# EAGLE design Rauchmelder 2.2C (EAGLE 7.2.0)
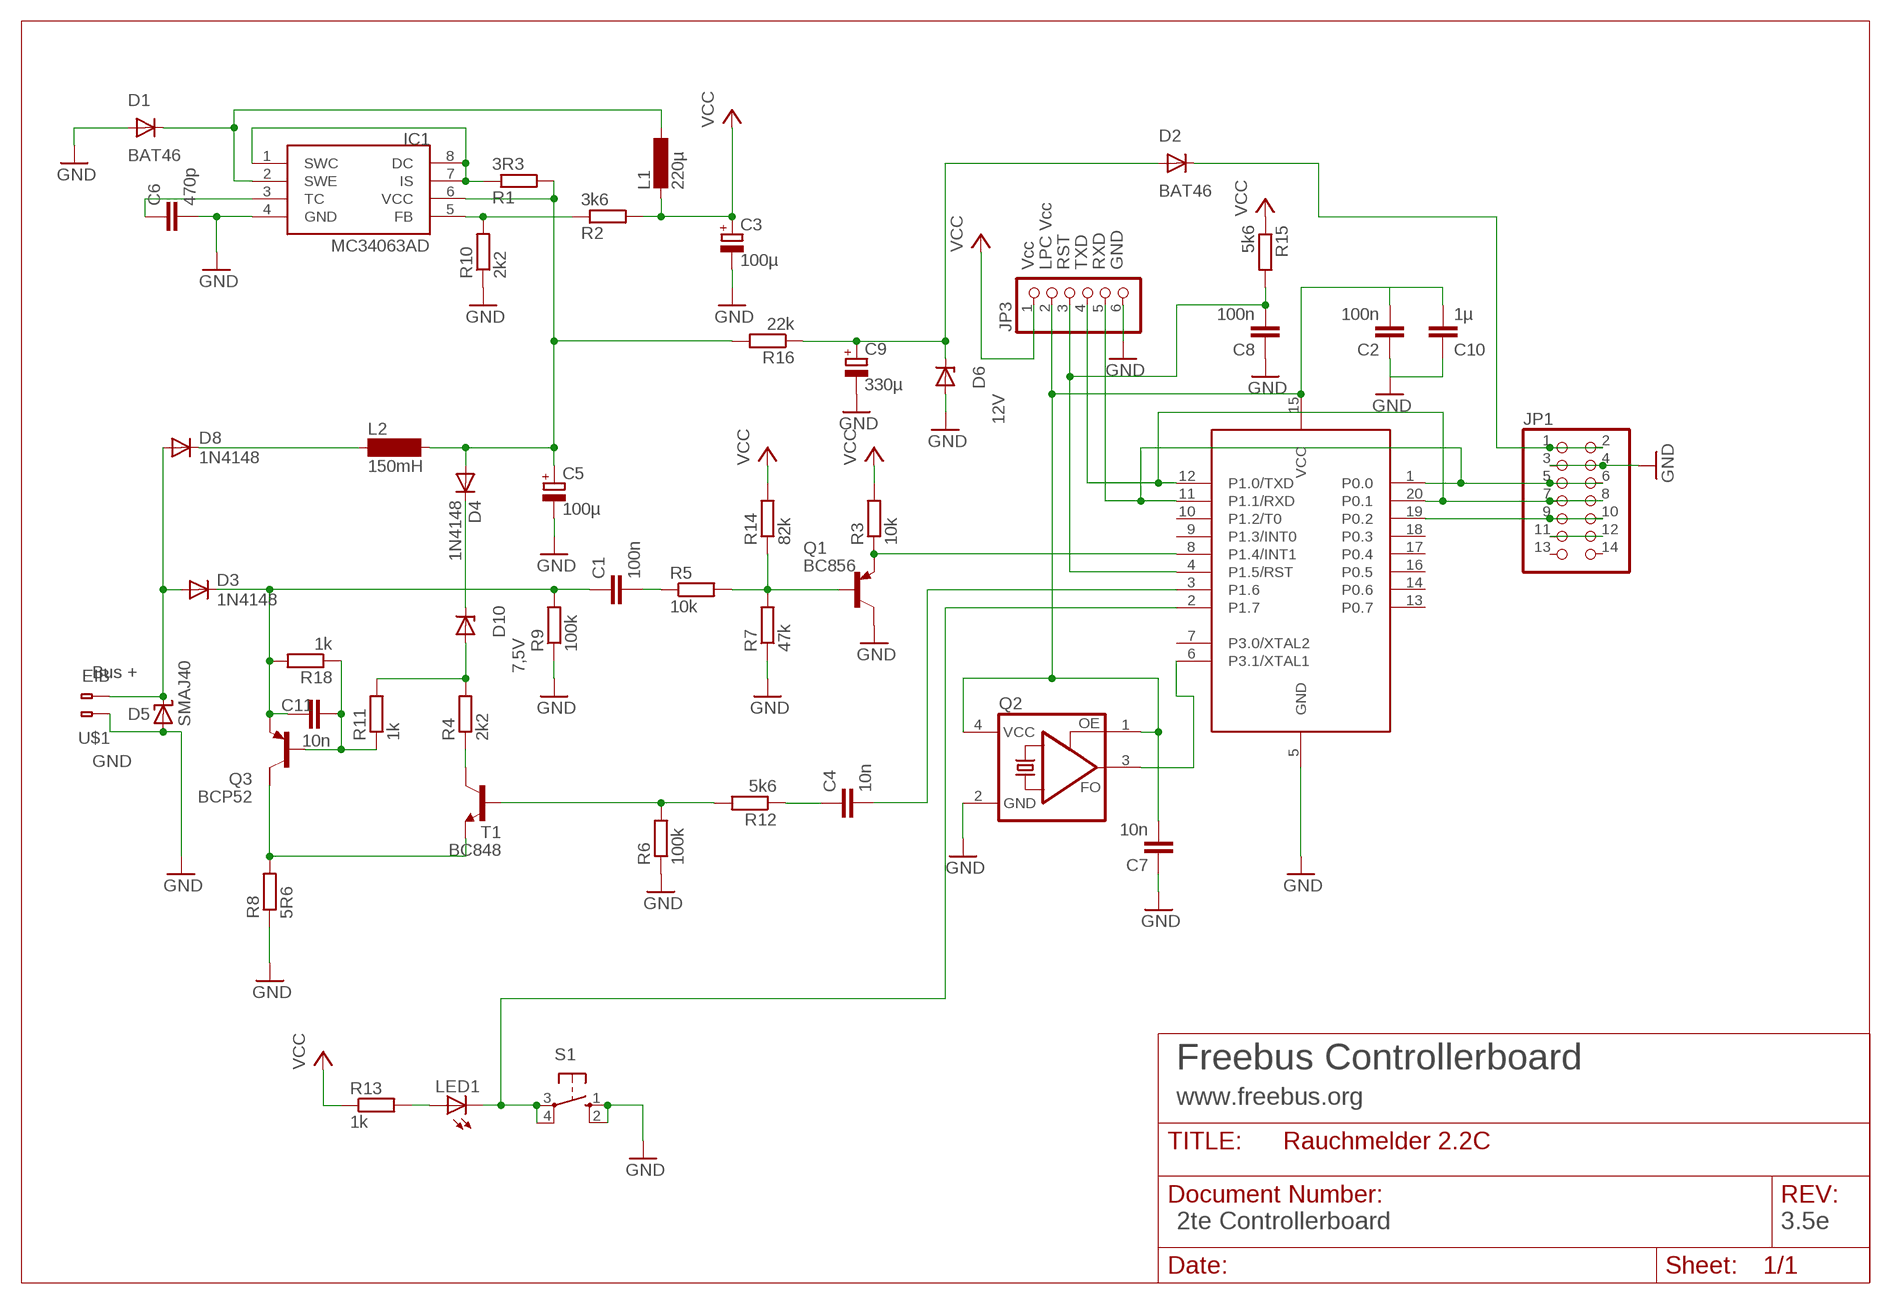
[diagram p0: schematic, sheet 1]

## Parts
C1  100n  C-EUC1206  [C1206]
C2  100n  C-EUC1206  [C1206]
C3  100µ  CPOL-EUSANYO_SMD_B6  [SANYO-OSCON_SMD_B6]
C4  10n  C-EUC1206  [C1206]
C5  100µ  CPOL-EUSANYO_SMD_C6  [SANYO-OSCON_SMD_C6]
C6  470p  C-EUC1206  [C1206]
C7  10n  C-EUC1206  [C1206]
C8  100n  C-EUC1206  [C1206]
C9  330µ  CPOL-EUE3.5-8  [E3,5-8]
C10  1µ  C-EUC1206  [C1206]
C11  10n  C-EUC1206  [C1206]
D1  BAT46  DIODE-MINIMELF  [MINIMELF]
D2  BAT46  DIODE-MINIMELF  [MINIMELF]
D3  1N4148  DIODE-MINIMELF  [MINIMELF]
D4  1N4148  DIODE-MINIMELF  [MINIMELF]
D5  SMAJ40  SUPPRESSOR-SMBJ  [SMBJ]
D6  12V  ZPD  [MINIMELF]
D8  1N4148  DIODE-MINIMELF  [MINIMELF]
D10  7,5V  ZPD  [MINIMELF]
IC1  MC34063AD  [SOIC8]
IC3  LPC922FDH  [TSSOP20]
JP1  PINHD-2X7  [2X07]
JP3  PINHD-1X6  [1X06]
L1  220µ  L-EU0207/10  [0207/10]
L2  150mH  BS11  [BS11]
LED1  LED3MM  [LED3MM]
Q1  BC856  BC856ALT1SMD  [SOT23-BEC]
Q2  ASFL  [ASF]
Q3  BCP52  FZT753SMD  [SOT223]
R1  3R3  R-EU_R1206  [R1206]
R2  3k6  R-EU_R1206  [R1206]
R3  10k  R-EU_R1206  [R1206]
R4  2k2  R-EU_R1206  [R1206]
R5  10k  R-EU_R1206  [R1206]
R6  100k  R-EU_R1206  [R1206]
R7  47k  R-EU_R1206  [R1206]
R8  5R6  R-EU_R1206  [R1206]
R9  100k  R-EU_R1206  [R1206]
R10  2k2  R-EU_R1206  [R1206]
R11  1k  R-EU_R1206  [R1206]
R12  5k6  R-EU_R1206  [R1206]
R13  1k  R-EU_R1206  [R1206]
R14  82k  R-EU_R1206  [R1206]
R15  5k6  R-EU_R1206  [R1206]
R16  22k  R-EU_R1206  [R1206]
R18  1k  R-EU_R1206  [R1206]
S1  10-XX  [B3F-10XX]
T1  BC848  [SOT23]
U$1  EIB  [BUSKLEMME243-724]

## Nets
EIB+: D3.A D5.C D8.A U$1.2(B-2)
GND: C2.1 C3.- C5.- C6.2 C7.1 C8.1 C9.- C10.1 D1.A D5.A D6.A IC1.4(GND) IC3.5(GND) JP1.3 JP1.4 JP3.6 Q1.C Q2.2(GND) R6.1 R7.1 R8.1 R9.1 R10.1 S1.1(S) S1.2(S1) U$1.1(B-1)
N$1: IC3.8(P1.4/INT1) Q1.E R3.1
N$2: Q1.B R5.2 R7.2 R14.1
N$3: IC3.6(P3.1/XTAL1) Q2.3(FO)
N$4: C11.2 Q3.1(B) R11.1 R18.1
N$5: C4.2 IC3.3(P1.6)
N$6: C2.2 C7.2 C10.2 IC3.15(VCC) JP3.2 Q2.1(OE) Q2.4(VCC)
N$7: IC3.2(P1.7) LED1.K(C) S1.3(P) S1.4(P1)
N$8: IC1.1(SWC) IC1.7(IS) IC1.8(DC) R1.1
N$9: LED1.A R13.2
N$10: C9.+ D2.A D6.C R16.1
N$11: IC1.5(FB) R2.1 R10.2
N$12: D1.C IC1.2(SWE) L1.1
N$13: D8.C L2.1
N$14: C6.1 IC1.3(TC)
N$15: D4.C D10.C
N$16: C1.2 R5.1
N$17: C5.+ D4.A IC1.6(VCC) L2.2 R1.2 R16.2
N$18: D2.C JP1.1 JP1.2
N$19: C8.2 IC3.4(P1.5/RST) JP3.3 R15.2
N$21: IC3.19(P0.2) JP1.9 JP1.10
N$22: C4.1 R12.1
N$23: R4.1 T1.3(C)
N$24: JP1.11 JP1.12
N$25: D10.A R4.2 R11.2
N$26: Q3.2(C) R8.2 T1.2(E)
N$33: C1.1 C11.1 D3.C Q3.3(E) R9.2 R18.2
N$34: R6.2 R12.2 T1.1(B)
RX: IC3.1(P0.0) IC3.11(P1.1/RXD) JP1.5 JP1.6 JP3.5
TX: IC3.12(P1.0/TXD) IC3.20(P0.1) JP1.7 JP1.8 JP3.4
VCC: C3.+ JP3.1 L1.2 R2.2 R3.2 R13.1 R14.2 R15.1
Unconnected: IC3.7(P3.0/XTAL2) IC3.9(P1.3/INT0) IC3.10(P1.2/T0) IC3.13(P0.7) IC3.14(P0.6) IC3.16(P0.5) IC3.17(P0.4) IC3.18(P0.3) JP1.13 JP1.14 Q3.4(C/)

## Notes on the sheet
- Vcc | LPC Vcc | RST | TXD | RXD | GND
- Bus +
- GND
- Freebus Controllerboard
- www.freebus.org
- 2te Controllerboard | 3.5e

## Library data of the parts
C1 C2 C4 C6-C8 C10 C11 = rcl:C-EU: CAPACITOR, European symbol
C3 C5 C9 = rcl:CPOL-EU: POLARIZED CAPACITOR, European symbol
D1-D4 D8 = diode:DIODE-: DIODE
D5 = diode:SUPPRESSOR-: Suppressor diode
D6 D10 = diode:ZPD: Z DIODE 500 mW
IC1 = mc34063:MC34063
IC3 = LPCGira:LPC922FDH
JP1 = pinhead:PINHD-2X7: PIN HEADER
JP3 = pinhead:PINHD-1X6: PIN HEADER
L1 = rcl:L-EU: INDUCTOR, European symbol
L2 = inductor-neosid:BS: INDUCTOR nominal inductance, magnetically screened
LED1 = led:LED: LED OSRAM: - CHIPLED LG R971, LG N971, LY N971, LG Q971, LY Q971, LO R971, LY R971 LH N974, LH R974 LS Q976, LO Q976, LY Q976 LO Q996 - Hyper CHIPLED LW Q18S LB Q993, LB Q99A, LB R99A - SideLED LS A670, LO A670, LY A670, LG A670, LP A670 LB A673, LV A673, LT A673, LW A673 LH A674 LY A675 LS A676, LA A676, LO A676, LY A676, LW A676 LS A679, LY A679, LG A679 - Hyper Micro SIDELED® LS Y876, LA Y876, LO Y876, LY Y876 LT Y87S - SmartLED LW L88C, LW L88S LB L89C, LB L89S, LG L890 LS L89K, LO L89K, LY L89K LS L896, LA L896, LO L896, LY L896 - TOPLED LS T670, LO T670, LY T670, LG T670, LP T670 LSG T670, LSP T670, LSY T670, LOP T670, LYG T670 LG T671, LOG T671, LSG T671 LB T673, LV T673, LT T673, LW T673 LH T674 LS T676, LA T676, LO T676, LY T676, LB T676, LH T676, LSB T676, LW T676 LB T67C, LV T67C, LT T67C, LS T67K, LO T67K, LY T67K, LW E67C LS E67B, LA E67B, LO E67B, LY E67B, LB E67C, LV E67C, LT E67C LW T67C LS T679, LY T679, LG T679 LS T770, LO T770, LY T770, LG T770, LP T770 LB T773, LV T773, LT T773, LW T773 LH T774 LS E675, LA E675, LY E675, LS T675 LS T776, LA T776, LO T776, LY T776, LB T776 LHGB T686 LT T68C, LB T68C - Hyper Mini TOPLED® LB M676 - Mini TOPLED Santana® LG M470 LS M47K, LO M47K, LY M47K Source: http://www.osram.convergy.de - LUMILED® LXK2-PW12-R00, LXK2-PW12-S00, LXK2-PW14-U00, LXK2-PW14-V00 LXK2-PM12-R00, LXK2-PM12-S00, LXK2-PM14-U00 LXK2-PE12-Q00, LXK2-PE12-R00, LXK2-PE12-S00, LXK2-PE14-T00, LXK2-PE14-U00 LXK2-PB12-K00, LXK2-PB12-L00, LXK2-PB12-M00, LXK2-PB14-N00, LXK2-PB14-P00, LXK2-PB14-Q00 LXK2-PR12-L00, LXK2-PR12-M00, LXK2-PR14-Q00, LXK2-PR14-R00 LXK2-PD12-Q00, LXK2-PD12-R00, LXK2-PD12-S00 LXK2-PH12-R00, LXK2-PH12-S00 LXK2-PL12-P00, LXK2-PL12-Q00, LXK2-PL12-R00 Source: www.luxeon.com
Q1 = transistor-pnp:BC856*: PNP Transistror
Q2 = crystal:ASF*: CRYSTAL CLOCK OSCILLATORS 5.0 Vdc or 3.3 Vdc - LOW PROFILE ULTRA MINIATURE CERAMIC SURFACE MOUNT Source: http://www.abracon.com/Oscillators/asf1-L-L1.pdf
Q3 = transistor-pnp:FZT753SMD: PNP Transistor
R1-R16 R18 = rcl:R-EU_: RESISTOR, European symbol
S1 = switch-omron:10-XX: OMRON SWITCH
T1 = transistor:BC848: NPN TRANSISTOR
U$1 = con-wago:EIB

## Board
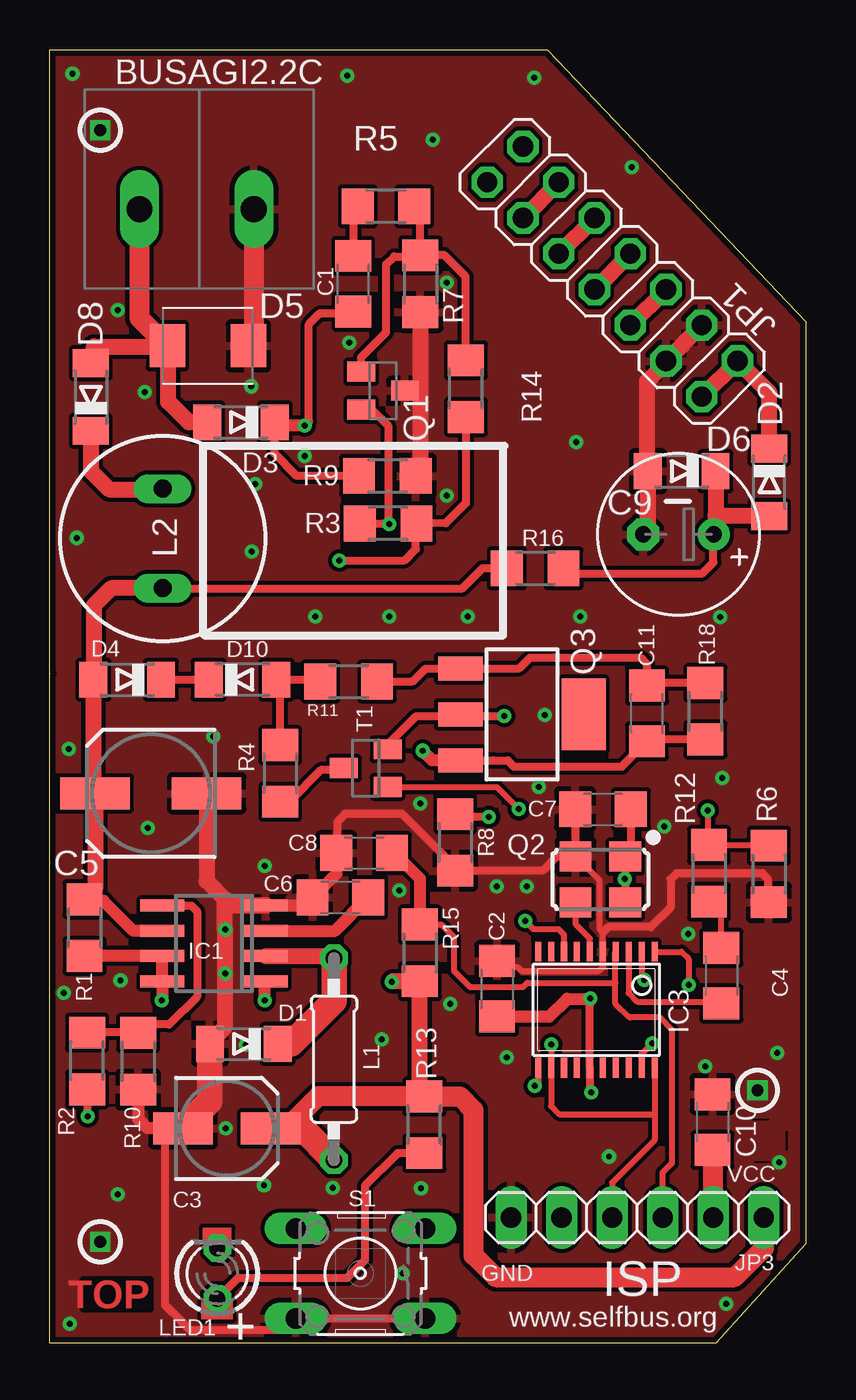
[diagram p1: board, top side]
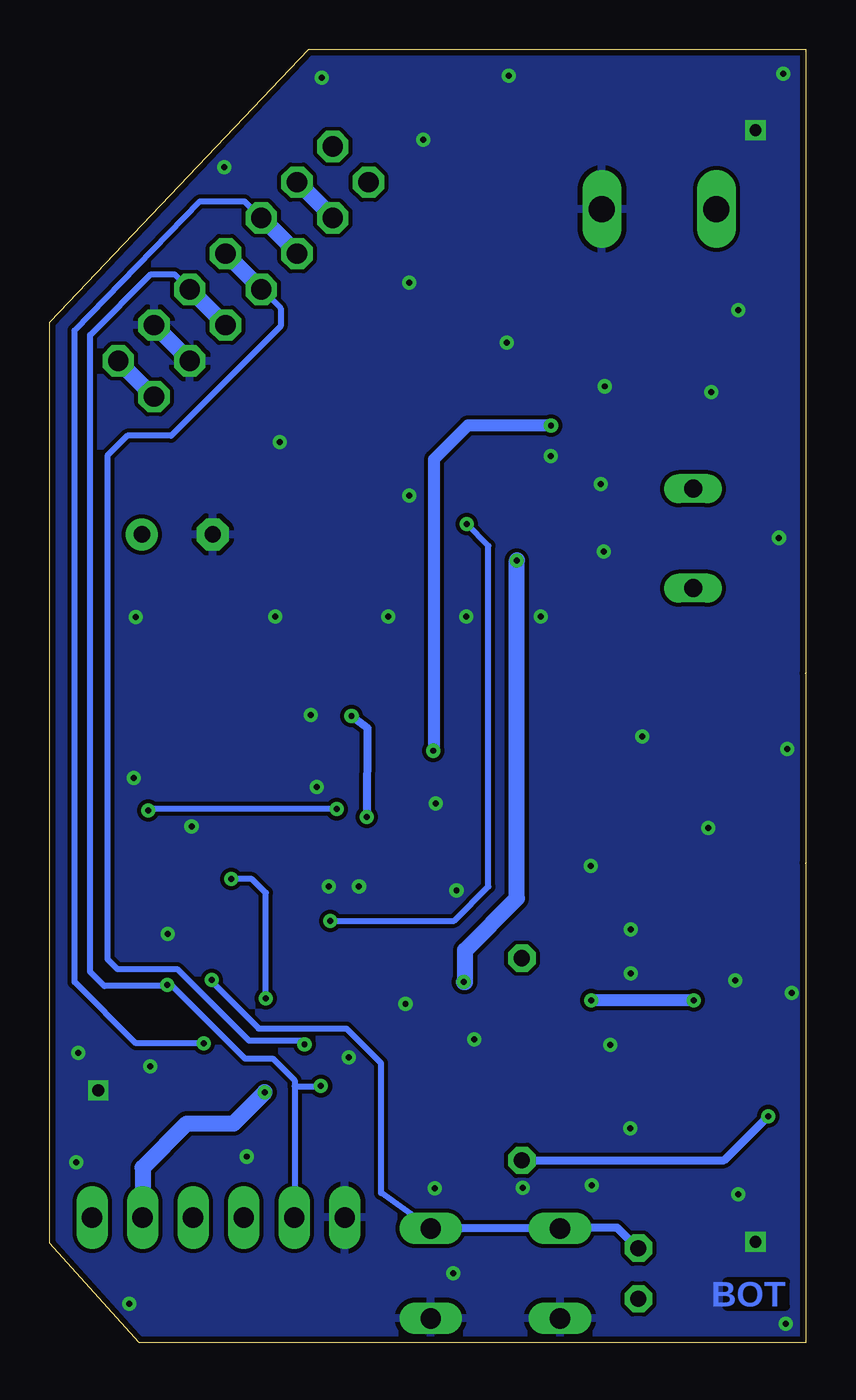
[diagram p2: board, bottom side, seen from below]

Size 38 x 65 mm. Coordinates in mm from the lower left corner, seen from the top.
Outline: 0,33.66 0.04,33.66
Outline: 0.04,24.13 0,24.13
Outline: 0,0 0,65 25,65 38,51.3 38,5 33.5,0 0,0
Copper layers (1*16): Top 0.035mm / dielectric 1.5mm / Bottom 0.035mm
Design rules "default *": minimum track width 10mil, minimum drill 0.3mm, track to track 8mil, track to pad 8mil, pad to pad 8mil, via to via 8mil, smd to smd 8mil, copper to edge 12mil, drill to drill 8mil, minimum pad ring 11mil, minimum via ring 8mil, stop-mask expansion 4mil, vias tented up to drill 0mil, thermal gap 10mil
tRestrict: area 35.3,11.2 to 36.1,11.3; area 35.4,9 to 36.2,9.1; area 37,9.7 to 37.1,10.6

### Footprints (pad centres in the part's own frame; a part is rotated, then mirrored left to right if it is on the bottom)
C1206 = smd 1.6 x 1.8: 1 -1.4,0; 2 1.4,0
SANYO-OSCON_SMD_B6 = smd 3 x 1.6: + 2.2,0; - -2.2,0
SANYO-OSCON_SMD_C6 = smd 3.5 x 1.6: + 2.8,0; - -2.8,0
E3,5-8 = drill 0.813 pad 1.6: + -1.778,0 | drill 0.813 pad 1.6 octagon: - 1.778,0
MINIMELF = smd 1.4 x 1.8: A 1.7,0; C -1.7,0
SMBJ = smd 1.78 x 2.16: A 2.04,0; C -2.03,0
SOIC8 = smd 0.6 x 2.2: 1 -1.905,-2.6; 2 -0.635,-2.6; 3 0.635,-2.6; 4 1.905,-2.6; 5 1.905,2.6; 6 0.635,2.6; 7 -0.635,2.6; 8 -1.905,2.6
TSSOP20 = smd 0.305 x 0.991: 1 -2.925,-2.918; 2 -2.275,-2.918; 3 -1.625,-2.918; 4 -0.975,-2.918; 5 -0.325,-2.918; 6 0.325,-2.918; 7 0.975,-2.918; 8 1.625,-2.918; 9 2.275,-2.918; 10 2.925,-2.918; 11 2.925,2.918; 12 2.275,2.918; 13 1.625,2.918; 14 0.975,2.918; 15 0.325,2.918; 16 -0.325,2.918; 17 -0.975,2.918; 18 -1.625,2.918; 19 -2.275,2.918; 20 -2.925,2.918
2X07 = drill 1.016 octagon: 1 -7.62,-1.27; 2 -7.62,1.27; 3 -5.08,-1.27; 4 -5.08,1.27; 5 -2.54,-1.27; 6 -2.54,1.27; 7 0,-1.27; 8 0,1.27; 9 2.54,-1.27; 10 2.54,1.27; 11 5.08,-1.27; 12 5.08,1.27; 13 7.62,-1.27; 14 7.62,1.27
1X06 = drill 1.016 long: 1 -6.35,0; 2 -3.81,0; 3 -1.27,0; 4 1.27,0; 5 3.81,0; 6 6.35,0
0207/10 = drill 0.813 octagon: 1 -5.08,0; 2 5.08,0
BS11 = drill 0.9 long: 1 -2.5,0; 2 2.5,0
LED3MM = drill 0.813 octagon: A -1.27,0; K 1.27,0
SOT23-BEC = smd 1 x 1.4: B -0.95,-1.1; C 0,1.1; E 0.95,-1.1
ASF = smd 1.6 x 1.5: 1 -1.25,-1.15; 2 1.25,-1.15; 3 1.25,1.15; 4 -1.25,1.15
SOT223 = smd 1.219 x 2.235: 1 -2.311,-3.099; 2 0,-3.099; 3 2.311,-3.099 | smd 3.6 x 2.2: 4 0,3.099
R1206 = smd 1.6 x 1.803: 1 -1.422,0; 2 1.422,0
B3F-10XX = drill 1.016 long: 1 -3.251,2.261; 2 3.251,2.261; 3 -3.251,-2.261; 4 3.251,-2.261
SOT23 = smd 1 x 1.4: 1 -0.95,-1.1; 2 0.95,-1.1; 3 0,1.1
BUSKLEMME243-724 = drill 1.3 long: 1 -2.875,0; 2 2.875,0

### Placement (x,y rotation side)
C1  15.24,53.24 90 top
C2  22.48,17.81 270 top
C3  8.9,10.78 0 top
C4  33.75,18.46 270 top
C5  5.08,27.62 180 top
C6  14.6,22.39 180 top
C7  27.8,26.83 0 top
C8  15.8,24.63 0 top
C9  31.59,40.64 180 top
C10  33.3,11.1 270 top
C11  30.01,31.64 90 top
D1  9.75,15.03 180 top
D2  36.15,43.26 270 top
D3  9.6,46.28 180 top
D4  3.89,33.34 180 top
D5  7.94,50.12 0 top
D6  31.75,43.81 180 top
D8  2.06,47.55 90 top
D10  9.68,33.34 0 top
IC1  8.26,20.08 90 top
IC3  27.46,16.75 180 top
JP1  28.27,53.85 135 top
JP3  29.53,6.3 180 top
L1  14.28,14.26 270 top
L2  5.67,40.44 270 top
LED1  8.42,3.49 90 top
Q1  16.75,47.86 270 top
Q2  27.67,23.3 180 top
Q3  23.73,31.59 270 top
R1  1.75,20.88 90 top
R2  1.87,14.18 270 top
R3  17,41.19 0 top
R4  11.58,28.63 90 top
R5  16.89,57.13 0 top
R6  36.13,23.57 90 top
R7  18.62,53.24 90 top
R8  20.38,25.16 90 top
R9  16.96,43.58 180 top
R10  4.44,14.16 90 top
R11  15.02,33.25 180 top
R12  33.12,23.6 90 top
R13  18.82,10.96 270 top
R14  20.91,47.96 270 top
R15  18.6,19.61 90 top
R16  24.39,38.93 180 top
R18  32.94,31.75 270 top
S1  15.61,3.49 180 top
T1  15.88,28.89 90 top
U$1  7.38,56.99 180 top

### Tracks (layer width: path | path; a pad name or v marks a point on that pad's centre or on a via)
EIB+
  Top 0.406: D8.A 2.22,49.25 | 5.91,50.09 D5.C 5.95,50.07
  Top 0.813: 2.22,49.25 2.22,50.09 5.91,50.09 | D3.A 6.99,46.28 5.95,47.31 5.95,50.07
  Top 1.016: U$1.2 4.51,51.52 D5.C
GND  (via drill 0.3, 0.6)
  Top 0.305: Q2.2 27.62,23.24 27.62,20.8 27.79,20.63 IC3.5 27.8,19.66 27.8,18.9 27.6,18.7 23.7,18.7 23.5,18.9 23,18.9 22.48,19.43 C2.1
  Top 0.406: 30,43.86 D6.A | 10.8,21.95 IC1.4 | C8.1 14.45,24.89 14.45,26.19 14.84,26.59 17.7,26.59 20.3,24 R8.1 20.93,23.73 24.77,23.73 25.48,24.45 Q2.2 26.42,27 C7.1 | S1.1 S1.2 11.78,0.66 7.02,0.66 6.62,1.05 6.62,1.08 5.8,1.9 5.8,10.48 C3.- 7.14,10.66 | R6.1 36.43,22.15 36.1,22.1 36.1,23.3 35.8,23.6 31.5,23.6 31.2,23.3 31.2,21.9 30.2,20.9 28.06,20.9 27.79,20.63 | 18.62,43.53 18.43,43.53 R9.1 | Q1.C 18.56,47.86 18.62,47.8
  Top 0.61: IC1.4 13,22 13.39,22.39 C6.2 14.4,23.58 C8.1 | R10.1 4.44,11.26 4.9,10.8 6.08,10.8 C3.-
  Top 0.813: D6.A 30.05,40.88 C9.- | 30,43.86 30,48.33 30.96,49.28 JP1.4 JP1.3 | C5.- 7.88,23.22 8.8,22.3 8.8,22 | D1.A 8.81,15.89 v8.81,18.57 v8.81,20.78 8.8,20.79 8.8,22 | 9.29,21.99 IC1.4 | IC1.4 8.8,22 | R7.1 18.62,47.8 18.62,43.53
  Top 1.016: U$1.1 10.26,50.39 D5.A
  Top 1.27: C3.- 8.05,12.13 D1.A
  other vias: 28.1,9.37 10.32,43.18 10.16,39.77 3.41,51.91 4.76,47.78 26.44,45.29 0.95,29.84 4.92,25.88 3.55,18.22 0.71,17.59 3.41,7.46 10.76,7.93 8.84,10.78 17.73,3.51 14.23,7.8 18.65,7.78 20.13,17.05 18.61,27.12 32.94,13.89 36.56,14.57 23.97,22.94 30.88,25.96 22.46,22.94 13.34,36.51 17.07,36.51 21,36.51 26.66,36.51 33.68,36.49 10.12,48.08 8.22,30.48 10.81,23.98 36.66,9.07 33.78,28.39 24.34,63.59 29.24,59.09 14.94,63.69 19.24,60.49 1.14,63.79 1.36,40.47 22.97,14.36 16.67,15.26 9.84,14.98 1.01,0.96 34,1.97 19.94,42.59 15.04,50.29 12.82,44.58 19.94,53.29 24.58,27.96 24.88,31.56 32.08,20.56 17.56,22.74 0.95,29.84 35.56,12.7 2.54,60.96 2.54,5.08
  pour Top: -1,-0.8 -1.2,66.1 -0.7,66.6 25.9,66.6 39.9,52.6 39.9,2.7 36.6,-0.6
  pour Bottom: -0.7,66.7 26.3,66.7 40.4,52.6 40.4,3.1 35.9,-1.4 -0.5,-1.4 -1.1,-0.5
N$1  (via drill 0.3)
  Top 0.305: IC3.8 25.84,20.52 25.56,20.8 24.3,20.8 23.88,21.22 v23.9,21.22
  Top 0.406: R3.1 16.82,41.19 v17.05,41.16 17,41.21 17,46.1 16.19,46.91 Q1.E
  Bottom 0.305: v23.9,21.22 17.68,21.22 15.96,22.94 15.96,40.05 v17.05,41.16
N$2
  Top 0.406: Q1.B 15.65,49.54 16.91,50.8 16.91,54.21 17.3,54.61 17.86,54.61 18.27,55.02 R7.2 | R7.2 18.62,57.07 R5.2 | R14.1 20.9,53.6 19.81,54.69 18.64,54.69 R7.2
N$3
  Top 0.305: IC3.6 27.14,20.33 26.43,21.03 26.43,22.13 Q2.3
N$4
  Top 0.406: R18.1 30.14,33.17 C11.2 30,34.13 29.69,34.45 24.13,34.45 23.58,33.9 Q3.1 18.89,33.89 18.24,33.25 R11.1
N$5
  Top 0.305: IC3.3 29.09,17.58 29.53,17.14 33.66,17.14 C4.2
N$6  (via drill 0.3)
  Top 0.305: 27.14,17.47 27.15,16.98 | v28.88,23.32 28.92,23.42
  Top 0.406: C7.2 29.2,24.73 Q2.1 28.92,23.42 Q2.4 | 27.14,17.47 IC3.15 27.14,12.66 v27.2,12.6 | 27.15,16.98 v27.15,17.32
  Top 0.61: C2.2 25.11,16.41 26,17.3 27.17,17.3 v27.15,17.32
  Top 1.016: C10.2 33.3,6.14 JP3.2
  Bottom 0.305: v27.15,17.32 27.15,22.62 27.84,23.32 v28.88,23.32
  Bottom 0.61: 33.34,6.1 JP3.2
  Bottom 0.813: 33.34,6.1 33.34,8.81 31.12,11.03 28.77,11.03 v27.2,12.6
N$7  (via drill 0.3)
  Top 0.305: IC3.2 29.74,18.38 v29.86,18.26
  Bottom 0.305: v29.86,18.26 29.86,18.16 27.5,15.8 23.09,15.8 21.35,14.06 21.35,7.54 S1.3
  Bottom 0.406: LED1.K 8.46,4.76 9.5,5.79 13.02,5.79 S1.4 S1.3
N$8  (via drill 0.3)
  Top 0.406: R1.1 | 10.8,18.12 IC1.1
  Top 0.61: R1.1 IC1.7 IC1.8 5.66,17.24 v5.64,17.23 | v10.8,17.23 10.8,18.12
  Bottom 0.61: v5.64,17.23 v10.8,17.23
N$9
  Top 0.406: R13.2 17.48,9.54 15.83,7.89 15.83,4.16 14.92,3.25 9.46,3.25 LED1.A
N$10
  Top 0.406: 33.45,40.72 C9.+ 33.34,40.61 33.34,39.23 32.78,38.67 25.88,38.67 25.82,38.93 R16.1 | 33.48,41.56 33.45,41.59
  Top 0.813: D6.C 33.45,41.59 33.45,40.72 | D2.A 33.48,41.56
N$11
  Top 0.406: IC1.5 7.11,21.99 7.4,21.7 7.4,17.4 6,16 3.96,16 R10.2 | 4.32,15.6 R2.1
  Top 0.61: R10.2 4.32,15.6 3.92,16
N$12
  Top 0.813: IC1.2 14.17,19.45 L1.1
  Top 1.27: D1.C 12.13,15.03 14.3,17.2 14.3,19.32 L1.1
N$13
  Top 0.406: 2.07,43.95 2.07,43.83
  Top 0.813: D8.C 2.07,43.95 | 2.07,43.83 3,42.9 5.6,42.9 L2.1
N$14
  Top 0.61: IC1.3 14.33,20.72 C6.1
N$15
  Top 0.406: D4.C D10.C
N$16
  Top 0.406: R5.1 15.24,57.57 C1.2
N$17
  Top 0.406: 2.22,33.37 D4.A | 2.19,27.71 C5.+ | 1.82,22.23 R1.2 | R16.2 21.73,38.93 20.7,37.9 5.71,37.9 L2.2
  Top 0.61: IC1.6 4.21,20.72 2.7,22.23 1.82,22.23
  Top 0.813: L2.2 3.09,37.94 2.22,37.07 2.22,33.37 | D4.A 2.19,27.71 | C5.+ 2.28,22.83 R1.2
N$18
  Top 0.813: D2.C 36.15,47.76 JP1.1 JP1.2
N$19
  Top 0.305: IC3.4 28.42,19.64 28.42,18.1 | JP3.3 30.8,8.57 31.27,9.05 31.27,15.72 30.64,16.35 29.15,16.35 29.1,16.4 28.42,17.05 28.42,18.1 | R15.2 19.67,21.03 20.3,20.4 20.3,18.7 21.1,17.9 23.8,17.9 24,18.1 28.42,18.1
  Top 0.406: R15.2 18.1,21.51 | 17.15,24.79 C8.2
  Top 0.61: 17.15,24.79 18.6,23.34 R15.2
N$20
  Bottom 0.813: 23.8,56.6 25.6,58.4
N$21  (via drill 0.3)
  Top 0.305: IC3.19 29.74,14.53 v30.27,15.06
  Top 0.813: JP1.9 JP1.10
  Bottom 0.305: v30.27,15.06 33.67,15.06 36.75,18.14 36.75,50.9 30.46,57.39 28.22,57.39 JP1.9
N$22
  Top 0.305: C4.1 33.75,22.05 R12.1
N$23
  Top 0.406: R4.1 12.05,27.21 13.65,28.81 14.7,28.81 T1.3
N$24
  Top 0.813: JP1.11 JP1.12
N$25
  Top 0.406: R11.2 13.5,33.34 D10.A 11.58,33.14 R4.2
N$26  (via drill 0.3)
  Top 0.406: T1.2 16.98,30.07 18.42,31.51 20.56,31.51 | 20.56,31.51 Q3.2 | 20.56,31.51 22.54,31.51 v22.84,31.51 | v22.07,26.43 21.08,26.43 R8.2
  Bottom 0.406: v22.84,31.51 v22.84,31.52 22.05,30.9 v22.07,26.43
N$27
  Bottom 0.813: 25.6,54.7 25.6,54.8 27.4,56.6
N$28
  Bottom 0.813: 27.4,53 29.2,54.8
N$29
  Bottom 0.813: 29.2,51.2 31,53
N$30
  Bottom 0.813: 30.9,49.3 32.8,51.2
N$31
  Bottom 0.813: 32.7,47.6 32.8,47.6 34.6,49.4
N$33  (via drill 0.3)
  Top 0.406: 11.35,46.28 D3.C 11.3,44.7 12.42,43.58 R9.2 | C1.1 15.16,51.75 13.57,51.75 13.02,51.2 13.02,46.32 v12.81,46.11 | R18.2 30.1,30.33 C11.1 28.74,28.97 23.32,28.97 23.02,29.28 23,29.29 22.3,29.28 Q3.3
  Top 0.61: v18.73,29.77 19.21,29.29 Q3.3 | v12.81,46.11 11.47,46.11 D3.C
  Bottom 0.61: v12.81,46.11 16.99,46.11 18.7,44.4 18.7,29.8 v18.73,29.77
N$34  (via drill 0.3)
  Top 0.305: R6.2 33.65,25 R12.2 33.06,25.16 v33.06,26.77 | T1.1 22.46,27.94 v23.57,26.83
  Bottom 0.305: v23.57,26.83 33.02,26.83 v33.06,26.77
RX  (via drill 0.3)
  Top 0.305: IC3.1 31.73,19.67 32.1,19.3 v32.1,18 | IC3.11 24.54,13.08 v24.37,12.91
  Top 0.813: JP1.5 JP1.6
  Bottom 0.305: 32.1,17.93 35.25,17.93 35.98,18.66 35.98,50.66 32.92,53.72 31.73,53.72 JP1.5 | v32.1,18 32.1,17.93 | 32.1,17.93 31.83,17.93 28.2,14.3 26.8,14.3 25.7,13.2 25.7,12.9 | 25.7,12.9 25.7,6.12 JP3.5 | 25.7,12.9 24.39,12.9 v24.37,12.91
TX  (via drill 0.3)
  Top 0.305: IC3.20 30.39,11.5 | 30.39,11.5 30.39,10.19 28.26,8.06 28.26,6.1 JP3.4 | 30.39,11.5 25.6,11.5 25.19,11.91 IC3.12 25.2,13.84 v25.2,15
  Top 0.813: JP1.7 JP1.8
  Bottom 0.305: 27.35,52.95 26.4,52 26.4,51.1 31.9,45.6 34.1,45.6 35.1,44.6 35.1,19.3 34.6,18.8 31.6,18.8 28,15.2 25.3,15.2 v25.2,15
  Bottom 0.406: JP1.8 27.35,52.95
VCC  (via drill 0.3)
  Top 0.406: 17.23,18.18 v17.19,18.14 | v1.9,11.4 1.9,13.13 R2.2 | R14.2 20.91,42.21 19.9,41.2 R3.2 18.4,41.16 18.4,39.9 17.83,39.33 v14.55,39.33
  Top 0.61: 11.2,10.8 11.18,10.78 C3.+
  Top 0.813: 17.23,18.18 R15.1 18.6,12.61 R13.1
  Top 1.016: C3.+ 11.88,10.78 13.5,12.4 18.81,12.4 R13.1 20.61,12.39 21.3,11.7 21.3,4.4 22.4,3.3 34.42,3.3 35.88,4.76 JP3.1
  Top 1.27: L1.2 12.66,10.8 11.2,10.8
  Bottom 0.406: 14.53,39.34 v14.55,39.33 | L1.2 4.12,9.18 v1.9,11.4
  Bottom 0.813: 14.53,39.34 14.53,22.35 17.13,19.74 17.13,18.14 v17.19,18.14
(copper drawn outside any net)
  shapes: Top area x2

### Text on the board
Top: TOP
Bottom: BOT
tPlace: BUSAGI2.2C | +
tNames: VCC | GND | ISP | www.selfbus.org
tValues: 16V | 35V | 16V